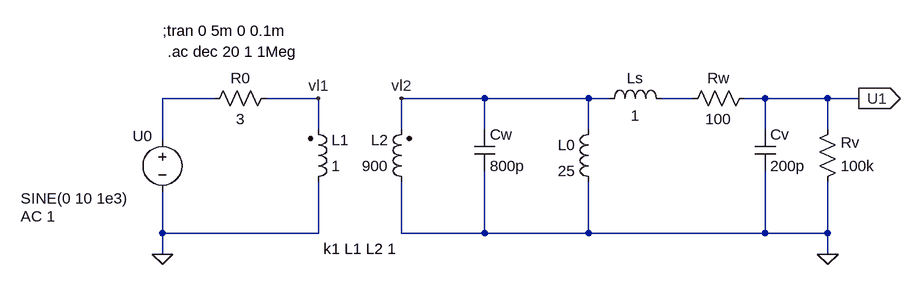
[diagram p0: schematic hw7p1.asc]
hw7p1.asc, the LTspice schematic file:
Version 4
SHEET 1 1036 680
WIRE -48 16 -128 16
WIRE 112 16 32 16
WIRE 368 16 240 16
WIRE 528 16 368 16
WIRE 560 16 528 16
WIRE 688 16 640 16
WIRE 800 16 768 16
WIRE 896 16 800 16
WIRE 944 16 896 16
WIRE 112 64 112 16
WIRE 240 64 240 16
WIRE 368 64 368 16
WIRE 528 64 528 16
WIRE 800 64 800 16
WIRE 896 64 896 16
WIRE -128 80 -128 16
WIRE -128 224 -128 160
WIRE 112 224 112 144
WIRE 112 224 -128 224
WIRE 240 224 240 144
WIRE 368 224 368 128
WIRE 368 224 240 224
WIRE 528 224 528 144
WIRE 528 224 368 224
WIRE 800 224 800 128
WIRE 800 224 528 224
WIRE 896 224 896 144
WIRE 896 224 800 224
WIRE -128 256 -128 224
WIRE 896 256 896 224
FLAG -128 256 0
FLAG 944 16 U1
IOPIN 944 16 Out
FLAG 896 256 0
FLAG 112 16 vl1
FLAG 240 16 vl2
SYMBOL voltage -128 64 R0
WINDOW 0 -46 10 Left 2
WINDOW 3 -218 106 Left 2
WINDOW 123 -218 134 Left 2
WINDOW 39 0 0 Left 2
SYMATTR InstName U0
SYMATTR Value SINE(0 10 1e3)
SYMATTR Value2 AC 1
SYMBOL res 48 0 R90
WINDOW 0 0 56 VBottom 2
WINDOW 3 32 56 VTop 2
SYMATTR InstName R0
SYMATTR Value 3
SYMBOL ind 544 48 M0
SYMATTR InstName L0
SYMATTR Value 25
SYMBOL res 784 0 R90
WINDOW 0 0 56 VBottom 2
WINDOW 3 32 56 VTop 2
SYMATTR InstName Rw
SYMATTR Value 100
SYMBOL res 880 160 M180
WINDOW 0 36 76 Left 2
WINDOW 3 36 40 Left 2
SYMATTR InstName Rv
SYMATTR Value 100k
SYMBOL ind 544 32 R270
WINDOW 0 32 56 VTop 2
WINDOW 3 5 56 VBottom 2
SYMATTR InstName Ls
SYMATTR Value 1
SYMBOL ind2 96 160 M180
WINDOW 0 36 80 Left 2
WINDOW 3 36 40 Left 2
SYMATTR InstName L1
SYMATTR Value 1
SYMATTR Type ind
SYMBOL ind2 256 160 R180
WINDOW 0 36 80 Left 2
WINDOW 3 36 40 Left 2
SYMATTR InstName L2
SYMATTR Value 900
SYMATTR Type ind
SYMBOL cap 352 64 R0
SYMATTR InstName Cw
SYMATTR Value 800p
SYMBOL cap 784 64 R0
SYMATTR InstName Cv
SYMATTR Value 200p
TEXT -128 -88 Left 2 !;tran 0 5m 0 0.1m
TEXT 120 248 Left 2 !k1 L1 L2 1
TEXT -120 -56 Left 2 !.ac dec 20 1 1Meg

The netlist it stands for:
* hw7p1.asc
V§U0 N001 0 SINE(0 10 1e3) AC 1
R0 vl1 N001 3
L0 vl2 0 25
Rw U1 N002 100
Rv 0 U1 100k
Ls vl2 N002 1
L1 0 vl1 1
L2 0 vl2 900
Cw vl2 0 800p
Cv U1 0 200p
;tran 0 5m 0 0.1m
k1 L1 L2 1
.ac dec 20 1 1Meg
.backanno
.end